# Altium schematic sheet IIM-42652_breakout.SchDoc
size A4; SheetNumber: 1; SheetTotal: 1
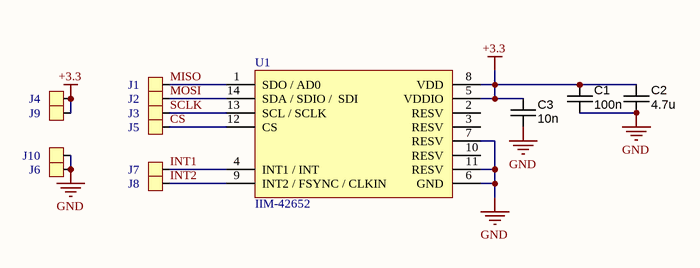
[diagram p0: IIM-42652_breakout.SchDoc]

## Parts
C1  100n  [CAPC1005X55N]
C2  value 4.7u  [CAPC1608X90N]  (hidden comment: approved sub OK)
C3  10n  [CAPC1005X55N]
J1  MISO  [PAD-1020]  (value not drawn)
J2  MOSI  [PAD-1020]  (value not drawn)
J3  SCLK  [PAD-1020]  (value not drawn)
J4  +3.3  [PAD-1020]  (value not drawn)
J5  CS  [PAD-1020]  (value not drawn)
J6  GND  [PAD-1020]  (value not drawn)
J7  INT1  [PAD-1020]  (value not drawn)
J8  INT2  [PAD-1020]  (value not drawn)
J9  +3.3  [PAD-1020]  (value not drawn)
J10  GND  [PAD-1020]  (value not drawn)
U1  IIM-42652  [IIM-42652_LGA14]

## Nets
+3.3: C1.1 C2.1 C3.1 J4.1 J9.1 U1.5(VDDIO) U1.8(VDD)
GND: C1.2 C2.2 C3.2 J6.1 J10.1 U1.6(GND) U1.7(RESV) U1.11(RESV)
CS: J5.1 U1.12(CS)
INT1: J7.1 U1.4(INT1_/_INT)
INT2: J8.1 U1.9(INT2_/_FSYNC_/_CLKIN)
MISO: J1.1 U1.1(SDO_/_AD0)
MOSI: J2.1 U1.14(SDA_/_SDIO_/__SDI)
SCLK: J3.1 U1.13(SCL_/_SCLK)

Not connected (* = marked no-connect by the designer): U1 2(RESV) 3(RESV) 10(RESV)

## Library data of the parts
C1 = CAPC_100n_0402_X5R_16V_10%: Capacitor SMD Cer 100nF 10% 16V X5R 0402; Manufacturer 1: AVX Corporation; Manufacturer Part Number 1: 0402YD104KAT2A; Ratings: 16V; X5R; SCDType: spec; Tolerance: ±10%; Operating Temperature: -55°C ~ 125°C; Package / Case: 0402 (1005 Metric); Size / Dimension: 0.039" L x 0.020" W (1.00mm x 0.50mm); Supplier 1: Digi-Key; Supplier Part Number 1: 478-1126-1-ND; ComponentLink1URL: http://www.avx.com/docs/Catalogs/cx5r.pdf; ComponentLink1Description: http://www.avx.com/docs/Catalogs/cx5r.pdf; Supplier 2: Digi-Key; Supplier Part Number 2: 311-1347-1-ND; Manufacturer 2: Yageo; Manufacturer Part Number 2: CC0402KRX5R7BB104; ComponentLink2URL: http://www.yageo.com/documents/recent/UPY-GPHC_X5R_4V-to-50V_12.pdf; ComponentLink2Description: http://www.yageo.com/documents/recent/UPY-GPHC_X5R_4V-to-50V_12.pdf; Value: 100n
C2 = CAPC_2u2_0603_10V_10%: Capacitor SMD Cer 2.2uF 10% 10V X5R 0603; Manufacturer 1: AVX Corporation; Manufacturer Part Number 1: 0603ZD225KAT2A; Ratings: 10V; X5R; Material: ceramic; SCDType: spec; Package / Case: 0603 (1608 metric); Tolerance: ±10%; Supplier 1: Digi-Key; Supplier Part Number 1: 478-6212-1-ND; ComponentLink1URL: http://www.avx.com/docs/Catalogs/cx5r.pdf; ComponentLink1Description: http://www.avx.com/docs/Catalogs/cx5r.pdf
C3 = CAPC_10n_0402_X7R_16V_10%: Capacitor SMD Cer 10nF 10% 16V X7R 0402; Manufacturer 1: AVX Corporation; Manufacturer Part Number 1: 0402YC103KAT2A; Ratings: 16V; X7R; SCDType: spec; Tolerance: ±10%; Operating Temperature: -55°C ~ 125°C; Package / Case: 0402 (1005 Metric); Size / Dimension: 0.039" L x 0.020" W (1.00mm x 0.50mm); Manufacturer 2: Yageo; Manufacturer Part Number 2: CC0402KRX7R7BB103; Supplier 1: Digi-Key; Supplier Part Number 1: 478-1114-1-ND; ComponentLink1URL: http://www.avx.com/docs/Catalogs/cx7r.pdf; ComponentLink1Description: http://www.avx.com/docs/Catalogs/cx7r.pdf; Supplier 2: Digi-Key; Supplier Part Number 2: 311-1042-1-ND; ComponentLink2URL: http://www.yageo.com/documents/recent/UPY-GPHC_X7R_6.3V-to-50V_8.pdf; ComponentLink2Description: http://www.yageo.com/documents/recent/UPY-GPHC_X7R_6.3V-to-50V_8.pdf; Value: 10n
J1-J10 = SOLDER-PAD